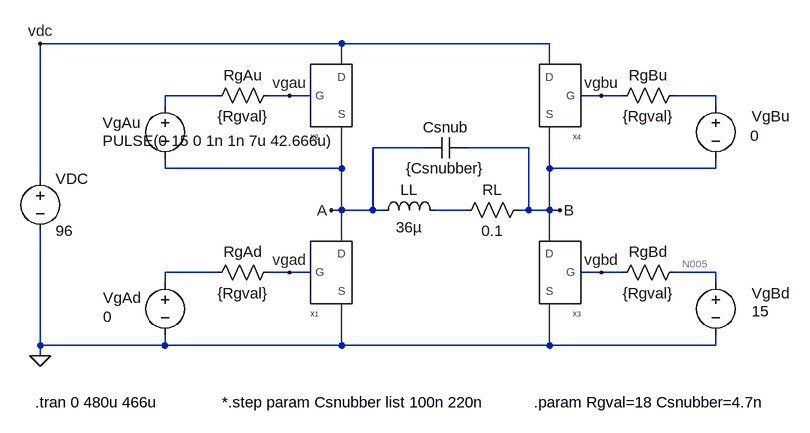
[diagram p0: schematic CircuitRg18.asc]
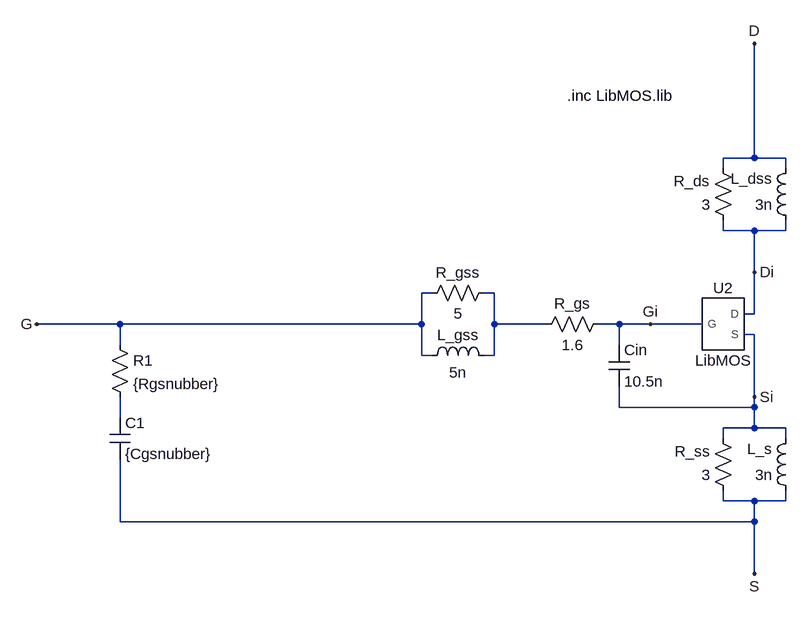
[diagram p1: sub-circuit mymos.asc]
CircuitRg18.asc, the LTspice schematic file:
Version 4
SHEET 1 1448 680
WIRE 192 -192 -272 -192
WIRE 512 -192 192 -192
WIRE 192 -160 192 -192
WIRE 512 -160 512 -192
WIRE 0 -112 -80 -112
WIRE 112 -112 80 -112
WIRE 144 -112 112 -112
WIRE 592 -112 560 -112
WIRE 624 -112 592 -112
WIRE 768 -112 704 -112
WIRE -80 -96 -80 -112
WIRE 768 -96 768 -112
WIRE 320 -32 240 -32
WIRE 480 -32 384 -32
WIRE -80 0 -80 -16
WIRE 192 0 192 -64
WIRE 192 0 -80 0
WIRE 512 0 512 -64
WIRE 768 0 768 -16
WIRE 768 0 512 0
WIRE -272 16 -272 -192
WIRE 192 64 192 0
WIRE 192 64 176 64
WIRE 240 64 240 -32
WIRE 240 64 192 64
WIRE 256 64 240 64
WIRE 384 64 336 64
WIRE 480 64 480 -32
WIRE 480 64 464 64
WIRE 512 64 512 0
WIRE 512 64 480 64
WIRE 528 64 512 64
WIRE 192 112 192 64
WIRE 512 112 512 64
WIRE 0 160 -80 160
WIRE 112 160 80 160
WIRE 144 160 112 160
WIRE 592 160 560 160
WIRE 624 160 592 160
WIRE 768 160 704 160
WIRE -80 176 -80 160
WIRE 768 176 768 160
WIRE -272 272 -272 96
WIRE -80 272 -80 256
WIRE -80 272 -272 272
WIRE 192 272 192 208
WIRE 192 272 -80 272
WIRE 512 272 512 208
WIRE 512 272 192 272
WIRE 768 272 768 256
WIRE 768 272 512 272
WIRE -272 288 -272 272
FLAG -272 288 0
FLAG 176 64 A
FLAG 528 64 B
FLAG 112 -112 vgau
FLAG 112 160 vgad
FLAG 592 -112 vgbu
FLAG 592 160 vgbd
FLAG -272 -192 vdc
SYMBOL MyMOS 192 160 R0
SYMATTR InstName X1
SYMBOL res 96 144 R90
WINDOW 0 0 56 VBottom 2
WINDOW 3 32 56 VTop 2
SYMATTR InstName RgAd
SYMATTR Value {Rgval}
SYMBOL voltage -80 160 R0
WINDOW 0 -95 39 Left 2
WINDOW 3 -95 68 Left 2
WINDOW 123 0 0 Left 0
WINDOW 39 0 0 Left 0
SYMATTR InstName VgAd
SYMATTR Value 0
SYMBOL MyMOS 192 -112 R0
SYMATTR InstName X2
SYMBOL res 96 -128 R90
WINDOW 0 0 56 VBottom 2
WINDOW 3 32 56 VTop 2
SYMATTR InstName RgAu
SYMATTR Value {Rgval}
SYMBOL voltage -80 -112 R0
WINDOW 0 -96 42 Left 2
WINDOW 3 -96 69 Left 2
WINDOW 123 0 0 Left 0
WINDOW 39 0 0 Left 0
SYMATTR InstName VgAu
SYMATTR Value PULSE(0 15 0 1n 1n 7u 42.666u)
SYMBOL MyMOS 512 160 M0
SYMATTR InstName X3
SYMBOL res 720 144 R90
WINDOW 0 0 56 VBottom 2
WINDOW 3 32 56 VTop 2
SYMATTR InstName RgBd
SYMATTR Value {Rgval}
SYMBOL voltage 768 160 R0
WINDOW 0 55 32 Left 2
WINDOW 3 55 60 Left 2
WINDOW 123 0 0 Left 0
WINDOW 39 0 0 Left 0
SYMATTR InstName VgBd
SYMATTR Value 15
SYMBOL voltage -272 0 R0
WINDOW 123 0 0 Left 0
WINDOW 39 0 0 Left 0
SYMATTR InstName VDC
SYMATTR Value 96
SYMBOL MyMOS 512 -112 M0
SYMATTR InstName X4
SYMBOL res 720 -128 R90
WINDOW 0 0 56 VBottom 2
WINDOW 3 32 56 VTop 2
SYMATTR InstName RgBu
SYMATTR Value {Rgval}
SYMBOL voltage 768 -112 R0
WINDOW 0 55 32 Left 2
WINDOW 3 53 62 Left 2
WINDOW 123 0 0 Left 0
WINDOW 39 0 0 Left 0
SYMATTR InstName VgBu
SYMATTR Value 0
SYMBOL res 480 48 R90
WINDOW 0 0 56 VBottom 2
WINDOW 3 32 56 VTop 2
SYMATTR InstName RL
SYMATTR Value 0.1
SYMBOL ind 240 80 R270
WINDOW 0 32 56 VTop 2
WINDOW 3 5 56 VBottom 2
SYMATTR InstName LL
SYMATTR Value 36µ
SYMBOL cap 320 -16 R270
WINDOW 0 32 32 VTop 2
WINDOW 3 0 32 VBottom 2
SYMATTR InstName Csnub
SYMATTR Value {Csnubber}
SYMATTR SpiceLine Rser=1 Rpar=0
TEXT -280 360 Left 2 !.tran 0 480u 466u
TEXT 8 360 Left 2 !*.step param Csnubber list 100n 220n
TEXT 488 360 Left 2 !.param Rgval=18 Csnubber=4.7n

mymos.asc, the sub-circuit schematic file:
Version 4
SHEET 1 880 680
WIRE 160 -128 160 -304
WIRE 160 -128 112 -128
WIRE 208 -128 160 -128
WIRE 112 -112 112 -128
WIRE 208 -112 208 -128
WIRE 112 -16 112 -32
WIRE 160 -16 112 -16
WIRE 208 -16 208 -32
WIRE 208 -16 160 -16
WIRE 160 48 160 -16
WIRE -336 80 -352 80
WIRE -240 80 -256 80
WIRE 160 112 160 48
WIRE 160 112 144 112
WIRE -816 128 -944 128
WIRE -352 128 -352 80
WIRE -352 128 -816 128
WIRE -240 128 -240 80
WIRE -160 128 -240 128
WIRE -48 128 -80 128
WIRE 0 128 -48 128
WIRE 80 128 0 128
WIRE 160 144 144 144
WIRE -816 160 -816 128
WIRE -48 160 -48 128
WIRE -352 176 -352 128
WIRE -336 176 -352 176
WIRE -240 176 -240 128
WIRE -240 176 -256 176
WIRE 160 240 160 144
WIRE -48 256 -48 224
WIRE 160 256 160 240
WIRE 160 256 -48 256
WIRE -816 272 -816 240
WIRE 160 288 160 256
WIRE 160 288 112 288
WIRE 208 288 160 288
WIRE 112 304 112 288
WIRE 208 304 208 288
WIRE 112 400 112 384
WIRE 160 400 112 400
WIRE 208 400 208 384
WIRE 208 400 160 400
WIRE -816 432 -816 336
WIRE 160 432 160 400
WIRE 160 432 -816 432
WIRE 160 512 160 432
FLAG -944 128 G
FLAG 160 -304 D
FLAG 160 512 S
FLAG 160 48 Di
FLAG 160 240 Si
FLAG 0 128 Gi
SYMBOL res -240 64 R90
WINDOW 0 0 56 VBottom 2
WINDOW 3 32 56 VTop 2
SYMATTR InstName R_gss
SYMATTR Value 5
SYMBOL res 128 -16 R180
WINDOW 0 36 76 Left 2
WINDOW 3 36 40 Left 2
SYMATTR InstName R_ds
SYMATTR Value 3
SYMBOL res 128 400 R180
WINDOW 0 36 76 Left 2
WINDOW 3 36 40 Left 2
SYMATTR InstName R_ss
SYMATTR Value 3
SYMBOL ind -352 192 R270
WINDOW 0 32 56 VTop 2
WINDOW 3 5 56 VBottom 2
SYMATTR InstName L_gss
SYMATTR Value 5n
SYMBOL ind 224 -16 R180
WINDOW 0 36 80 Left 2
WINDOW 3 36 40 Left 2
SYMATTR InstName L_dss
SYMATTR Value 3n
SYMBOL ind 224 400 R180
WINDOW 0 36 80 Left 2
WINDOW 3 36 40 Left 2
SYMATTR InstName L_s
SYMATTR Value 3n
SYMBOL res -64 112 R90
WINDOW 0 0 56 VBottom 2
WINDOW 3 32 56 VTop 2
SYMATTR InstName R_gs
SYMATTR Value 1.6
SYMBOL cap -64 160 R0
SYMATTR InstName Cin
SYMATTR Value 10.5n
SYMBOL LibMOS 112 128 R0
SYMATTR InstName U2
SYMATTR Value LibMOS
SYMBOL cap -832 272 R0
SYMATTR InstName C1
SYMATTR Value {Cgsnubber}
SYMBOL res -832 144 R0
SYMATTR InstName R1
SYMATTR Value {Rgsnubber}
TEXT -128 -224 Left 2 !.inc LibMOS.lib

The netlist it stands for:
* CircuitRg18.asc
XX1 vgad A 0 mymos
RgAd vgad N004 {Rgval}
VgAd N004 0 0
XX2 vgau vdc A mymos
RgAu vgau N001 {Rgval}
VgAu N001 A PULSE(0 15 0 1n 1n 7u 42.666u)
XX3 vgbd B 0 mymos
RgBd N005 vgbd {Rgval}
VgBd N005 0 15
VDC vdc 0 96
XX4 vgbu vdc B mymos
RgBu N002 vgbu {Rgval}
VgBu N002 B 0
RL B N003 0.1
LL A N003 36µ
Csnub A B {Csnubber} Rser=1 Rpar=0

* block symbol definitions
.subckt mymos G D S
R_gss N001 G 5
R_ds Di D 3
R_ss S Si 3
L_gss G N001 5n
L_dss Di D 3n
L_s S Si 3n
R_gs Gi N001 1.6
Cin Gi Si 10.5n
XU2 Gi Di Si LibMOS  ; pins G D S
C1 N002 S {Cgsnubber}
R1 G N002 {Rgsnubber}
.inc LibMOS.lib
.ends mymos

.tran 0 480u 466u
*.step param Csnubber list 100n 220n
.param Rgval=18 Csnubber=4.7n
.lib LibMOS.lib
.backanno
.end

* Results of the author's LTspice run, read from the files saved beside the schematic
* Operating Point, zero values left out:
*   V(vdc) = 96 V
*   V(vgbd) = 15 V
*   V(n005) = 15 V
*   I(Ll) = 1.921 µA
*   I(Rl) = -1.921 µA
*   I(Vdc) = -3.843 µA
*   Ix(x2:D) = 1.921 µA
*   Ix(x2:S) = -1.921 µA
*   Ix(x3:D) = 3.843 µA
*   Ix(x3:S) = -3.843 µA
*   Ix(x4:D) = 1.921 µA
*   Ix(x4:S) = -1.921 µA
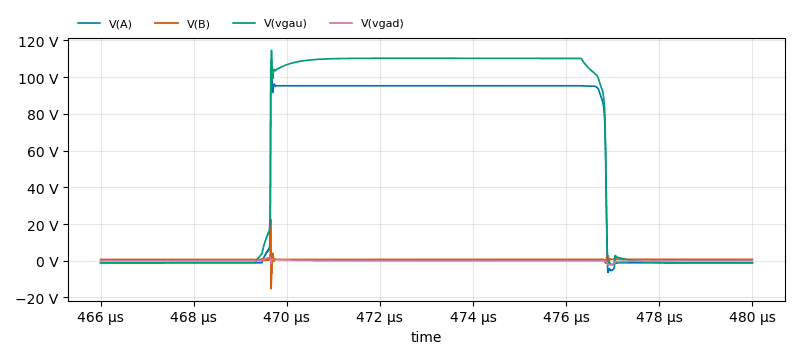
[diagram p2: Transient Analysis of CircuitRg18.asc, plotted from the saved traces]
* Transient Analysis, 1 run:
*   V(A): min -6.279 V, max 109.4 V, average 48.42 V, rms 68.18 V, last -1.16 V
*   V(B): min -15.27 V, max 22.64 V, average 737 mV, rms 974.7 mV, last 778.2 mV
*   V(vgau): min -2.266 V, max 114.6 V, average 55.92 V, rms 78.3 V, last -1.159 V
*   V(vgad): min -2.33 V, max 1.944 V, average -536.1 µV, rms 283.1 mV, last -751.1 µV